# EAGLE board ALU (EAGLE 9.6.2)
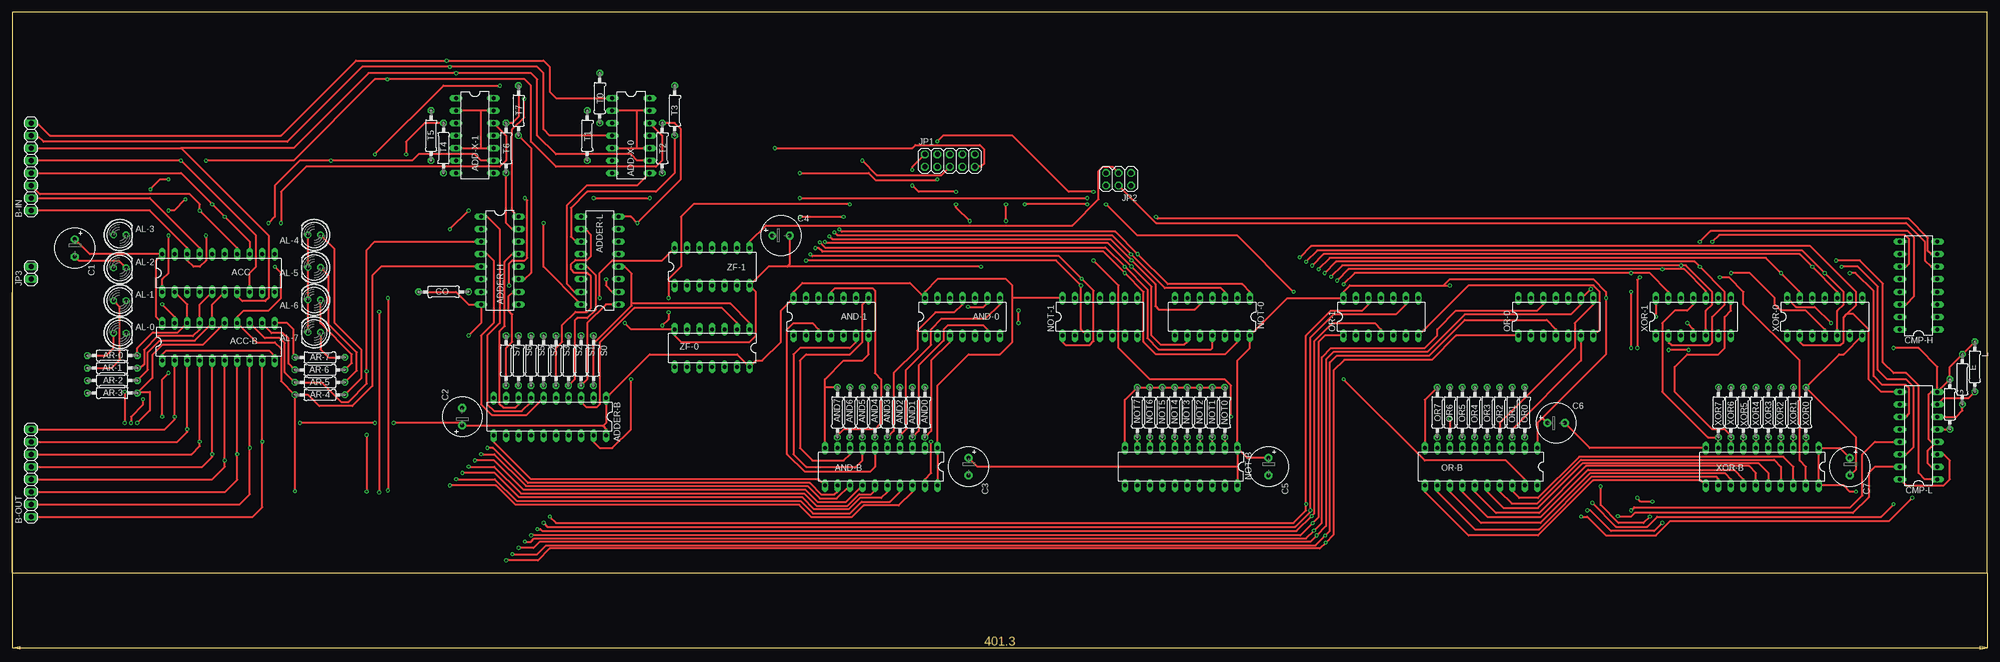
[diagram p3: board, top side]
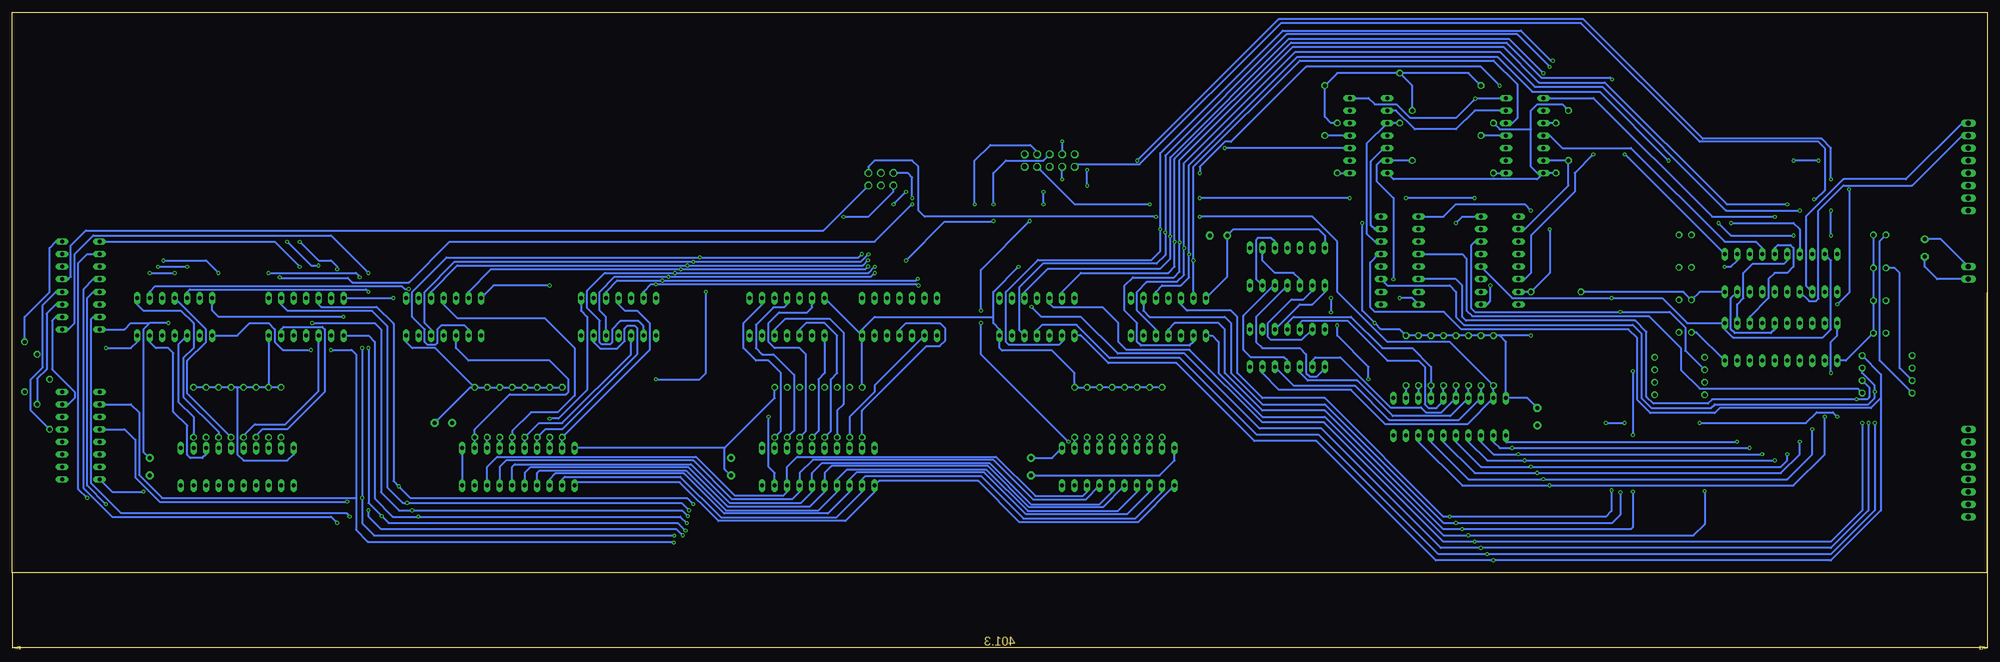
[diagram p4: board, bottom side, seen from below]

Size 401.3 x 113.97 mm. Coordinates in mm from the lower left corner, seen from the top.
Outline: 0,0 401.3,0 401.3,113.97 0,113.97 0,0
Copper layers (1*16): Top 0.035mm / dielectric 1.5mm / Bottom 0.035mm
Design rules "default": minimum track width 6mil, minimum drill 0.35mm, track to track 6mil, track to pad 6mil, pad to pad 6mil, via to via 6mil, smd to smd 6mil, copper to edge 40mil, drill to drill 6mil, minimum pad ring 10mil, minimum via ring 8mil, stop-mask expansion 4mil, vias tented up to drill 0mil, thermal gap 10mil

## Footprints (pad centres in the part's own frame; a part is rotated, then mirrored left to right if it is on the bottom)
DIL20 = drill 0.813 long: 1 -11.43,-3.81; 2 -8.89,-3.81; 3 -6.35,-3.81; 4 -3.81,-3.81; 5 -1.27,-3.81; 6 1.27,-3.81; 7 3.81,-3.81; 8 6.35,-3.81; 9 8.89,-3.81; 10 11.43,-3.81; 11 11.43,3.81; 12 8.89,3.81; 13 6.35,3.81; 14 3.81,3.81; 15 1.27,3.81; 16 -1.27,3.81; 17 -3.81,3.81; 18 -6.35,3.81; 19 -8.89,3.81; 20 -11.43,3.81
DIL14 = drill 0.813 long: 1 -7.62,-3.81; 2 -5.08,-3.81; 3 -2.54,-3.81; 4 0,-3.81; 5 2.54,-3.81; 6 5.08,-3.81; 7 7.62,-3.81; 8 7.62,3.81; 9 5.08,3.81; 10 2.54,3.81; 11 0,3.81; 12 -2.54,3.81; 13 -5.08,3.81; 14 -7.62,3.81
DIL16 = drill 0.813 long: 1 -8.89,-3.81; 2 -6.35,-3.81; 3 -3.81,-3.81; 4 -1.27,-3.81; 5 1.27,-3.81; 6 3.81,-3.81; 7 6.35,-3.81; 8 8.89,-3.81; 9 8.89,3.81; 10 6.35,3.81; 11 3.81,3.81; 12 1.27,3.81; 13 -1.27,3.81; 14 -3.81,3.81; 15 -6.35,3.81; 16 -8.89,3.81
LED5MM = drill 0.813 octagon: A -1.27,0; K 1.27,0
0207/10 = drill 0.813 octagon: 1 -5.08,0; 2 5.08,0
1X08 = drill 1.016 long: 1 -8.89,0; 2 -6.35,0; 3 -3.81,0; 4 -1.27,0; 5 1.27,0; 6 3.81,0; 7 6.35,0; 8 8.89,0
E3,5-8 = drill 0.813 pad 1.6: + -1.778,0 | drill 0.813 pad 1.6 octagon: - 1.778,0
2X05 = drill 1.016 octagon: 1 -5.08,-1.27; 2 -5.08,1.27; 3 -2.54,-1.27; 4 -2.54,1.27; 5 0,-1.27; 6 0,1.27; 7 2.54,-1.27; 8 2.54,1.27; 9 5.08,-1.27; 10 5.08,1.27
2X03 = drill 1.016 octagon: 1 -2.54,-1.27; 2 -2.54,1.27; 3 0,-1.27; 4 0,1.27; 5 2.54,-1.27; 6 2.54,1.27
1X02 = drill 1.016 long: 1 -1.27,0; 2 1.27,0

## Placement (x,y rotation side)
ACC  74273N  [DIL20]  41.91,60.96 0 top
ACC-B  74245N  [DIL20]  41.91,46.99 0 top
ADD-X-0  7486N  [DIL14]  125.73,88.9 270 top
ADD-X-1  7486N  [DIL14]  93.98,88.9 270 top
ADDER-B  74245N  [DIL20]  109.22,31.75 180 top
ADDER-H  74283N  [DIL16]  99.06,63.5 270 top
ADDER-L  74283N  [DIL16]  119.38,63.5 90 top
AL-0  [LED5MM]  21.84,48.77 0 top
AL-1  [LED5MM]  21.84,55.37 0 top
AL-2  [LED5MM]  21.84,61.98 0 top
AL-3  [LED5MM]  21.84,68.71 0 top
AL-4  [LED5MM]  61.34,68.71 180 top
AL-5  [LED5MM]  61.34,62.1 180 top
AL-6  [LED5MM]  61.34,55.5 180 top
AL-7  [LED5MM]  61.34,48.9 180 top
AND0  [0207/10]  185.42,32.64 270 top
AND1  [0207/10]  182.88,32.64 270 top
AND2  [0207/10]  180.34,32.64 270 top
AND3  [0207/10]  177.8,32.64 270 top
AND4  [0207/10]  175.26,32.64 270 top
AND5  [0207/10]  172.72,32.64 270 top
AND6  [0207/10]  170.18,32.64 270 top
AND7  [0207/10]  167.64,32.64 270 top
AND-0  74LS00N  [DIL14]  193.04,52.07 0 top
AND-1  74LS00N  [DIL14]  166.37,52.07 0 top
AND-B  74245N  [DIL20]  176.53,21.59 180 top
AR-0  [0207/10]  20.32,44.2 0 top
AR-1  [0207/10]  20.32,41.66 0 top
AR-2  [0207/10]  20.32,39.12 0 top
AR-3  [0207/10]  20.32,36.58 0 top
AR-4  [0207/10]  62.48,36.2 180 top
AR-5  [0207/10]  62.48,38.73 180 top
AR-6  [0207/10]  62.48,41.27 180 top
AR-7  [0207/10]  62.48,43.81 180 top
B-IN  [1X08]  3.81,82.55 90 top
B-OUT  [1X08]  3.81,20.32 90 top
C1  [E3,5-8]  12.7,66.04 270 top
C2  [E3,5-8]  91.44,31.75 90 top
C3  [E3,5-8]  194.31,21.59 270 top
C4  [E3,5-8]  156.21,68.58 0 top
C5  [E3,5-8]  255.27,21.59 270 top
C6  [E3,5-8]  313.69,30.48 0 top
C7  [E3,5-8]  373.38,21.59 270 top
CMP-H  7485AN  [DIL16]  387.35,58.42 90 top
CMP-L  7485AN  [DIL16]  387.35,27.94 90 top
CO  [0207/10]  87.63,57.15 0 top
E  [0207/10]  396.24,39.37 270 top
G  [0207/10]  393.7,34.29 270 top
JP1  [2X05]  190.5,83.82 0 top
JP2  [2X03]  224.79,80.01 180 top
JP3  [1X02]  3.81,60.96 90 top
L  [0207/10]  398.78,41.91 270 top
NOT0  [0207/10]  246.38,32.64 270 top
NOT1  [0207/10]  243.84,32.64 270 top
NOT2  [0207/10]  241.3,32.64 270 top
NOT3  [0207/10]  238.76,32.64 270 top
NOT4  [0207/10]  236.22,32.64 270 top
NOT5  [0207/10]  233.68,32.64 270 top
NOT6  [0207/10]  231.14,32.64 270 top
NOT7  [0207/10]  228.6,32.64 270 top
NOT-0  7404N  [DIL14]  243.84,52.07 180 top
NOT-1  7404N  [DIL14]  220.98,52.07 0 top
NOT-B  74245N  [DIL20]  237.49,21.59 180 top
OR0  [0207/10]  307.34,32.64 270 top
OR1  [0207/10]  304.8,32.64 270 top
OR2  [0207/10]  302.26,32.64 270 top
OR3  [0207/10]  299.72,32.64 270 top
OR4  [0207/10]  297.18,32.64 270 top
OR5  [0207/10]  294.64,32.64 270 top
OR6  [0207/10]  292.1,32.64 270 top
OR7  [0207/10]  289.56,32.64 270 top
OR-0  7432N  [DIL14]  313.69,52.07 0 top
OR-1  7432N  [DIL14]  278.13,52.07 0 top
OR-B  74245N  [DIL20]  298.45,21.59 180 top
S0  [0207/10]  118.11,43.18 270 top
S1  [0207/10]  115.57,43.18 270 top
S2  [0207/10]  113.03,43.18 270 top
S3  [0207/10]  110.49,43.18 270 top
S4  [0207/10]  107.95,43.18 270 top
S5  [0207/10]  105.41,43.18 270 top
S6  [0207/10]  102.87,43.18 270 top
S7  [0207/10]  100.33,43.18 270 top
T0  [0207/10]  119.38,96.52 270 top
T1  [0207/10]  116.84,88.9 270 top
T2  [0207/10]  132.08,86.36 270 top
T3  [0207/10]  134.62,93.98 270 top
T4  [0207/10]  87.63,86.36 90 top
T5  [0207/10]  85.09,88.9 270 top
T6  [0207/10]  100.33,86.36 270 top
T7  [0207/10]  102.87,93.98 270 top
XOR0  [0207/10]  364.49,32.64 270 top
XOR1  [0207/10]  361.95,32.64 270 top
XOR2  [0207/10]  359.41,32.64 270 top
XOR3  [0207/10]  356.87,32.64 270 top
XOR4  [0207/10]  354.33,32.64 270 top
XOR5  [0207/10]  351.79,32.64 270 top
XOR6  [0207/10]  349.25,32.64 270 top
XOR7  [0207/10]  346.71,32.64 270 top
XOR-0  7486N  [DIL14]  368.3,52.07 0 top
XOR-1  7486N  [DIL14]  341.63,52.07 0 top
XOR-B  74245N  [DIL20]  355.6,21.59 180 top
ZF-0  74LS00N  [DIL14]  142.24,45.72 180 top
ZF-1  74LS00N  [DIL14]  142.24,62.23 0 top

## Tracks (layer width: path | path; a pad name or v marks a point on that pad's centre or on a via)
ACC-0  (via drill 0.35)
  Top 0.4: ACC.2 35.56,54.61 ACC-B.18 33.66,48.9 28.57,48.9 25.4,45.72 AR-0.2 | v100.33,2.54 106.81,2.54 109.22,4.95 265.68,4.95 v266.89,6.16 268.48,7.75 268.48,41.15 270.64,43.31 288.42,43.31 293.37,48.26 OR-0.1 | v340.61,45.34 v336.55,45.34
  Bottom 0.4: AR-0.2 21.59,40.39 21.59,35.56 | ADDER-L.5 123.7,64.77 125.35,63.12 125.35,53.98 124.46,53.09 110.36,53.09 106.81,49.53 72.9,49.53 71.12,47.75 71.12,35.18 68.45,32.51 55.37,32.51 54.36,33.53 23.62,33.53 21.59,35.56 | 21.59,35.56 21.59,12.7 31.75,2.54 v100.33,2.54 112.07,2.54 136.32,26.8 148.9,26.8 164.77,42.67 178.56,42.67 184.15,48.26 AND-0.1 | XOR-0.1 355.6,48.26 353.06,50.8 349.25,50.8 347.98,49.53 347.98,46.99 346.33,45.34 v340.61,45.34 | v336.55,45.34 332.36,45.34 331.47,44.45 331.47,15.24 | 331.47,15.24 331.47,8.76 329.06,6.35 267.08,6.35 v266.89,6.16 | CMP-L.10 377.19,34.29 375.54,32.64 375.54,19.94 370.84,15.24 331.47,15.24
ACC-1  (via drill 0.35)
  Top 0.4: ACC.5 38.1,54.61 ACC-B.17 38.1,49.53 36.7,48.13 29.59,48.13 26.8,45.34 26.8,42.42 26.04,41.66 AR-1.2 | v22.86,36.83 v22.86,30.48 | v101.6,3.81 106.68,3.81 108.46,5.59 264.8,5.59 v266.76,7.56 267.72,8.51 267.72,42.8 269.11,44.2 287.91,44.2 295.15,51.44 311.79,51.44 313.69,49.53 OR-0.4 | XOR-0.4 368.3,49.53 364.49,53.34 359.41,53.34 358.14,54.61 358.14,55.88 353.06,60.96 v349.25,60.96 | v330.71,60.07 330.2,59.56 v330.2,45.72 | v333.25,14.48 330.96,14.48 v330.2,15.24
  Bottom 0.4: ADDER-L.3 121.92,58.42 109.22,58.42 107.95,57.15 107.95,52.07 106.3,50.42 72.01,50.42 70.23,48.64 70.23,35.56 68.2,33.53 56.13,33.53 55.37,34.29 24.13,34.29 22.86,35.56 v22.86,36.83 22.86,38.1 25.4,40.64 AR-1.2 | v22.86,30.48 22.86,12.7 31.75,3.81 v101.6,3.81 111.54,3.81 135.8,28.07 148.37,28.07 163.99,43.69 178.31,43.69 185.04,50.42 192.02,50.42 193.04,49.4 AND-0.4 | v349.25,60.96 331.47,60.96 330.71,60.2 v330.71,60.07 | v330.2,45.72 v330.2,15.24 330.2,10.03 327.79,7.62 266.83,7.62 v266.76,7.56 | CMP-L.12 378.46,29.21 376.3,27.05 376.3,19.43 371.35,14.48 v333.25,14.48
ACC-2  (via drill 0.35)
  Top 0.4: ACC.6 40.64,54.61 ACC-B.16 37.08,47.24 29.97,47.24 27.56,44.83 27.56,41.27 AR-2.2 | v26.54,35.31 26.54,34.16 24.13,31.75 v24.13,30.48 | v194.18,54.1 197.36,54.1 198.12,54.86 AND-0.9 | v102.87,5.08 105.92,5.08 107.19,6.35 263.78,6.35 v265.05,7.62 266.95,9.53 266.95,43.43 268.48,44.96 287.53,44.96 295.15,52.58 316.74,52.58 318.77,54.61 OR-0.9 318.96,55.88 v320.77,57.69 | v328.93,12.7 329.56,13.34 373.51,13.34 375.92,15.75 375.92,24.13 378.46,26.67 CMP-L.13
  Bottom 0.4: AR-2.2 24,37.72 24,35.69 24.38,35.31 v26.54,35.31 55.88,35.31 56.77,34.42 67.82,34.42 69.22,35.81 69.22,49.02 71.5,51.31 105.92,51.31 106.68,52.07 106.68,58.42 107.95,59.69 ADDER-L.14 | v24.13,30.48 24.13,12.7 31.75,5.08 v102.87,5.08 111.02,5.08 135.27,29.34 147.85,29.34 163.09,44.58 176.66,44.58 184.15,52.07 192.15,52.07 v194.18,54.1 | XOR-0.9 373.38,57.15 372.24,58.29 322.14,58.29 321.54,57.69 v320.77,57.69 | v265.05,7.62 266.32,8.89 326.39,8.89 328.93,11.43 v328.93,12.7
ACC-3  (via drill 0.35)
  Top 0.4: ACC-B.15 38.73,46.35 30.48,46.35 28.45,44.32 28.45,39.62 AR-3.2 25.65,36.83 27.94,36.83 27.94,33.02 v25.4,30.48 | v104.14,6.35 105.41,6.35 106.05,6.99 262.89,6.99 v264.48,8.57 266.06,10.16 266.06,43.81 267.97,45.72 287.02,45.72 289.56,48.26 289.56,49.53 293.37,53.34 309.88,53.34 311.15,54.61 OR-0.12 | v328.93,57.15 v328.93,45.72 | CMP-L.15 378.46,21.59 377.19,20.32 377.19,15.37 374.01,12.19 329.69,12.19 328.93,11.43 326.39,11.43 v326.26,11.56
  Bottom 0.4: ACC-B.15 43.18,49.53 43.94,48.77 51.31,48.77 52.07,49.53 52.07,55.88 ACC.9 | ADDER-L.12 106.68,64.77 105.79,63.88 105.79,53.34 104.65,52.2 68.71,52.2 62.23,45.72 62.23,41.27 58.42,37.47 26.29,37.47 AR-3.2 | v25.4,30.48 25.4,12.7 31.75,6.35 v104.14,6.35 110.49,6.35 134.75,30.61 147.32,30.61 162.05,45.34 174.88,45.34 176.53,46.99 176.53,50.8 179.71,53.98 189.74,53.98 190.5,54.74 AND-0.12 | XOR-0.12 365.76,57.15 365.25,57.66 329.44,57.66 v328.93,57.15 | v328.93,45.72 328.93,14.22 v326.26,11.56 324.87,10.16 266.06,10.16 v264.48,8.57
ACC-4  (via drill 0.35)
  Top 0.4: v53.34,62.23 54.61,60.96 54.61,55.88 52.07,53.34 46.99,53.34 45.72,52.07 ACC-B.14 49.66,46.86 53.34,46.86 54.61,45.59 54.61,38.99 AR-4.2 | AR-4.2 60.07,36.2 62.36,33.91 69.09,33.91 73.15,37.97 73.15,60.45 74.93,62.23 ADDER-H.5 | AR-4.2 v57.4,16.64 | v105.41,7.62 261.75,7.62 v264.22,10.1 265.43,11.3 265.43,46.99 266.7,48.26 OR-1.1 | v318.77,11.43 320.04,11.43 323.85,7.62 334.01,7.62 336.93,10.54 381.38,10.54 v386.08,15.24
  Bottom 0.4: v53.34,62.23 52.07,62.23 50.8,63.5 ACC.12 | v57.4,16.64 57.4,9.91 59.69,7.62 v105.41,7.62 110.49,7.62 134.62,31.75 147.32,31.75 156.21,40.64 156.21,46.99 157.48,48.26 AND-1.1 | XOR-1.1 328.93,48.26 327.66,46.99 327.66,15.11 323.98,11.43 v318.77,11.43 265.56,11.43 v264.22,10.1 | CMP-H.10 386.08,64.77 387.86,62.99 387.86,17.02 v386.08,15.24
ACC-5  (via drill 0.35)
  Top 0.4: ACC-B.13 51.31,47.75 54.36,47.75 55.37,46.74 55.37,40.77 AR-5.2 62.87,38.73 66.8,34.8 68.33,34.8 72.01,38.48 v72.01,41.02 72.01,65.66 73.66,67.31 ADDER-H.3 | v72.01,28.07 v72.01,16.51 | v106.68,8.89 107.31,8.89 107.7,8.51 260.99,8.51 v264.03,11.56 264.54,12.06 264.54,47.12 268.22,50.8 276.86,50.8 278.13,49.53 OR-1.4 | XOR-1.4 341.63,49.53 v340.36,50.8 | v335.28,10.16 333.63,8.51 324.87,8.51 320.68,12.7 v320.04,12.7
  Bottom 0.4: ACC.15 43.18,66.04 42.55,66.67 40.01,66.67 39.37,66.04 39.37,62.23 40.64,60.96 43.18,60.96 44.45,59.69 44.45,55.88 48.26,52.07 ACC-B.13 | v72.01,41.02 v72.01,28.07 | v72.01,16.51 72.01,9.27 72.39,8.89 v106.68,8.89 110.49,8.89 134.62,33.02 147.32,33.02 154.94,40.64 154.94,49.53 156.21,50.8 165.1,50.8 166.37,49.53 AND-1.4 | v264.03,11.56 265.18,12.7 v320.04,12.7 322.71,12.7 326.39,16.38 326.39,49.53 327.66,50.8 v340.36,50.8 | CMP-H.12 384.81,59.69 386.84,57.66 386.84,17.27 381,11.43 336.55,11.43 v335.28,10.16
ACC-6  (via drill 0.35)
  Top 0.4: AR-6.2 56.13,42.55 56.13,47.62 54.99,48.77 52.7,48.77 50.8,50.67 ACC-B.12 | v74.55,53.09 v74.55,16.38 | v107.95,10.16 108.71,9.4 260.73,9.4 263.78,12.45 v263.78,12.7 263.78,47.88 268.48,52.58 281.18,52.58 283.21,54.61 OR-1.9 | v321.06,14.22 325.88,9.4 332.23,9.4 334.26,11.43 379.73,11.43 v382.27,13.97
  Bottom 0.4: ACC.16 40.64,63.5 41.27,62.87 47.62,62.87 49.53,60.96 49.53,55.88 50.8,54.61 ACC-B.12 | ADDER-H.14 104.14,67.31 104.9,66.55 104.9,53.85 104.14,53.09 v74.55,53.09 64.52,53.09 61.34,49.91 61.34,45.21 AR-6.2 | v74.55,16.38 74.55,11.81 76.2,10.16 v107.95,10.16 110.49,10.16 134.62,34.29 147.32,34.29 153.67,40.64 153.67,50.8 154.94,52.07 170.18,52.07 171.45,53.34 AND-1.9 | XOR-1.9 346.71,54.61 345.44,53.34 328.3,53.34 325.12,50.16 325.12,17.4 321.94,14.22 v321.06,14.22 265.3,14.22 v263.78,12.7 | v382.27,13.97 386.08,17.78 386.08,55.88 384.81,57.15 CMP-H.13
ACC-7  (via drill 0.35)
  Top 0.4: AR-7.2 57.15,44.07 57.15,49.53 55.88,50.8 ACC-B.11 | v76.33,55.88 v76.33,16.76 | v109.22,11.43 110.49,10.16 260.35,10.16 262.89,12.7 v262.89,13.97 262.89,48.26 267.97,53.34 274.32,53.34 275.59,54.61 OR-1.12 | v332.74,11.43 331.47,10.16 326.39,10.16 322.77,13.78 v322.77,17.59
  Bottom 0.4: ACC.19 31.75,63.5 31.75,49.53 33.4,47.88 51.69,47.88 53.34,49.53 ACC-B.11 60.96,50.8 66.04,55.88 v76.33,55.88 96.52,55.88 ADDER-H.12 | v76.33,16.76 76.33,12.57 77.47,11.43 v109.22,11.43 110.49,11.43 134.62,35.56 147.32,35.56 152.4,40.64 152.4,52.07 153.67,53.34 162.56,53.34 163.83,54.61 AND-1.12 | XOR-1.12 339.09,54.61 338.58,54.1 327.28,54.1 323.85,50.67 323.85,18.67 v322.77,17.59 320.42,15.24 264.16,15.24 v262.89,13.97 | CMP-H.15 384.81,52.07 385.32,51.56 385.32,18.29 379.22,12.19 333.5,12.19 v332.74,11.43
ACC-B  (via drill 0.35)
  Top 0.4: ACC-B.19 33.02,52.07 v30.48,54.61 | v28.07,77.98 30.1,80.01 v31.75,80.01 | v172.72,83.82 175.64,80.9 188.85,80.9 JP1.5
  Bottom 0.4: v30.48,54.61 27.94,57.15 27.94,77.85 v28.07,77.98 | v31.75,80.01 31.75,86.36 33.66,88.27 57.78,88.27 82.04,112.52 144.02,112.52 v172.72,83.82
ACC-CLR  (via drill 0.35)
  Top 0.4: ACC.1 30.48,59.69 31.75,60.96 v31.75,68.58 | v35.18,75.95 32.89,73.66 v31.75,73.66
  Bottom 0.4: v31.75,68.58 v31.75,73.66 | JP1.1 184.91,83.06 172.21,83.06 143.51,111.76 82.55,111.76 58.42,87.63 34.29,87.63 33.02,86.36 33.02,77.72 34.8,75.95 v35.18,75.95
ACC-CP  (via drill 0.35)
  Top 0.4: v73.66,85.09 87.63,99.06 v99.06,99.06 | v160.02,81.28 173.99,81.28 175.51,79.76 187.71,79.76 v187.96,80.01
  Bottom 0.4: ACC.11 v73.66,85.09 | v99.06,99.06 102.87,102.87 138.43,102.87 153.67,87.63 154.94,87.63 160.02,82.55 v160.02,81.28 | v187.96,80.01 JP1.3
ADDER-B  (via drill 0.35)
  Top 0.4: v170.18,74.93 138.43,74.93 135.89,72.39 135.89,62.23 133.35,59.69 v133.35,55.88 | ADDER-B.19 118.11,26.67 119.38,25.4 121.92,25.4 125.73,29.21 v125.73,39.37 | v133.35,52.96 133.35,51.56 v132.08,50.29
  Bottom 0.4: JP1.7 185.42,74.93 v170.18,74.93 | v125.73,39.37 125.73,41.91 132.08,48.26 v132.08,50.29 | v133.35,55.88 v133.35,52.96
AND-0
  Top 0.4: AND-0.3 190.5,46.99 186.69,43.18 186.69,28.83 AND0.2
  Bottom 0.4: AND-B.2 AND0.2
AND-1
  Top 0.4: AND-0.6 198.12,49.53 197.36,50.29 189.99,50.29 189.23,49.53 189.23,47.24 184.15,42.16 184.15,28.83 AND1.2
  Bottom 0.4: AND1.2 AND-B.3
AND-2
  Top 0.4: AND-0.8 200.66,54.61 197.74,51.69 188.85,51.69 186.69,49.53 186.69,46.35 181.61,41.27 181.61,29.21 180.34,27.94 AND2.2
  Bottom 0.4: AND2.2 AND-B.4
AND-3
  Top 0.4: AND-0.11 193.04,54.61 191.39,52.96 187.58,52.96 183.9,49.28 183.9,45.47 179.07,40.64 179.07,28.83 AND3.2
  Bottom 0.4: AND3.2 AND-B.5
AND-4
  Top 0.4: AND-B.6 175.26,21.59 174.24,20.57 161.04,20.57 157.48,24.13 157.48,49.53 158.75,50.8 162.56,50.8 163.83,49.53 AND-1.3
  Bottom 0.4: AND4.2 AND-B.6
AND-5
  Top 0.4: AND-1.6 171.45,46.99 170.18,45.72 160.02,45.72 158.75,44.45 158.75,24.13 161.29,21.59 171.45,21.59 172.72,22.86 AND-B.7
  Bottom 0.4: AND-B.7 AND5.2
AND-6
  Top 0.4: AND-1.8 172.72,54.61 172.72,46.99 170.18,44.45 161.29,44.45 160.02,43.18 160.02,25.4 162.56,22.86 168.91,22.86 170.18,24.13 AND-B.8
  Bottom 0.4: AND6.2 AND-B.8
AND-7
  Top 0.4: AND-1.11 166.37,57.15 167.13,57.91 174.75,57.91 175.26,57.4 175.26,40.64 176.53,39.37 176.53,30.48 175.26,29.21 168.91,29.21 167.64,27.94 AND7.2
  Bottom 0.4: AND-B.9 AND7.2
AND-B  (via drill 0.35)
  Top 0.4: AND-B.19 185.42,19.05 186.69,20.32 v186.69,26.67 | v204.47,50.8 v204.47,53.34 | v194.56,71.5 191.77,74.3 v191.77,74.93 | v191.77,77.47 184.15,77.47 v182.88,78.74 | v182.88,81.92 182.88,82.55 JP1.2
  Bottom 0.4: v186.69,26.67 204.47,44.45 v204.47,50.8 | v204.47,53.34 204.47,61.59 v194.56,71.5 | v191.77,74.93 v191.77,77.47 | v182.88,78.74 v182.88,81.92
BI-0  (via drill 0.35)
  Top 0.4: B-IN.8 5.08,91.44 7.62,88.9 54.61,88.9 69.85,104.14 v88.27,104.14 107.95,104.14 109.22,102.87 109.22,97.79 110.49,96.52 ADD-X-0.1 | NOT-0.1 251.46,57.15 249.94,58.67 234.82,58.67 v228.66,64.83 224.16,69.34 168.53,69.34 v168.02,69.85 | XOR-0.2 363.22,46.99 363.86,46.35 371.48,46.35 372.11,46.99 372.11,51.94 372.81,52.64 | v261.62,64.14 263.91,66.42 365.38,66.42 374.65,57.15 374.65,54.48 372.81,52.64 | CMP-L.9 379.73,36.83 377.19,39.37 377.19,49.53 374.08,52.64 372.81,52.64
  Bottom 0.4: B-IN.8 5.08,91.44 16.51,80.01 29.21,80.01 36.83,72.39 36.83,58.42 ACC.3 | AND-0.2 187.96,46.99 188.59,46.35 198.75,46.35 199.39,46.99 199.39,57.15 192.91,63.63 169.8,63.63 168.02,65.41 v168.02,69.85 168.02,85.34 143.13,110.24 94.74,110.24 88.65,104.14 v88.27,104.14 | OR-0.2 308.61,49.53 309.37,50.29 314.2,50.29 314.96,49.53 314.96,46.74 315.34,46.35 316.87,46.35 317.5,46.99 317.5,49.53 320.04,52.07 320.04,57.15 313.06,64.14 v261.62,64.14 229.36,64.14 v228.66,64.83
BI-1  (via drill 0.35)
  Top 0.4: ADD-X-0.4 109.22,88.9 107.95,90.17 107.95,101.6 106.68,102.87 v88.9,102.87 71.12,102.87 55.88,87.63 6.35,87.63 5.08,88.9 B-IN.7 | NOT-0.3 246.38,57.15 245.62,57.91 234.19,57.91 v227.33,64.77 223.52,68.58 167.64,68.58 v167,69.22 | XOR-0.5 370.84,53.34 372.11,54.61 372.11,57.15 v368.3,60.96 363.73,65.53 265.18,65.53 v262.89,63.25 | CMP-L.11 384.81,31.75 385.44,32.38 385.44,37.47 384.68,38.23 379.98,38.23 378.21,40.01 378.21,57.28 374.52,60.96 v373.38,60.96
  Bottom 0.4: B-IN.7 5.08,88.9 15.24,78.74 29.21,78.74 34.29,73.66 34.29,55.75 34.8,55.24 36.2,55.24 ACC.4 | v88.9,102.87 95.5,109.47 142.37,109.47 167,84.84 v167,69.22 167,64.64 168.78,62.87 191.9,62.87 196.72,58.04 196.72,49.4 AND-0.5 | OR-0.5 316.23,49.53 317.5,50.8 317.5,57.15 311.4,63.25 v262.89,63.25 228.85,63.25 v227.33,64.77 | v373.38,60.96 v368.3,60.96
BI-2  (via drill 0.35)
  Top 0.4: B-IN.6 34.29,86.36 | 34.29,86.36 52.07,68.58 52.07,55.88 51.44,55.24 46.74,55.24 45.72,56.26 ACC.7 | ADD-X-0.9 127,83.82 125.73,85.09 110.49,85.09 106.68,88.9 106.68,100.33 105.41,101.6 v90.17,101.6 72.39,101.6 57.15,86.36 34.29,86.36 | v165.99,68.45 166.62,67.82 223.14,67.82 v227.39,63.56 232.28,58.67 232.28,54.23 232.92,53.59 240.28,53.59 241.3,54.61 NOT-0.5 | XOR-0.10 370.84,57.15 v365.76,62.23 363.22,64.77 266.45,64.77 v264.16,62.48 | CMP-L.14 384.81,24.13 386.33,25.65 386.33,37.85 384.81,39.37 381,39.37 379.1,41.27 379.1,58.17 375.03,62.23 v371.73,62.23
  Bottom 0.4: AND-0.10 195.58,57.15 190.88,61.85 168.02,61.85 165.99,63.88 v165.99,68.45 165.99,84.45 141.86,108.58 97.16,108.58 v90.17,101.6 | OR-0.10 316.23,57.15 310.9,62.48 v264.16,62.48 228.47,62.48 v227.39,63.56 | v371.73,62.23 v365.76,62.23
BI-3  (via drill 0.35)
  Top 0.4: ACC.8 48.26,60.96 49.53,62.23 49.53,68.58 v34.29,83.82 B-IN.5 | v39.37,83.82 57.15,83.82 73.66,100.33 v76.2,100.33 104.14,100.33 105.41,99.06 105.41,87.63 110.49,82.55 130.81,82.55 132.08,83.82 132.08,88.9 ADD-X-0.12 | NOT-0.9 238.76,46.99 238.12,46.35 233.43,46.35 231.52,48.26 231.52,58.17 v227.39,62.29 222.63,67.06 165.35,67.06 v165.1,67.31 | XOR-0.13 363.22,57.15 v359.41,60.96 356.36,64.01 267.72,64.01 v265.43,61.72 | CMP-L.1 388.62,19.05 387.35,20.32 387.35,38.1 384.81,40.64 382.27,40.64 380.11,42.8 380.11,58.8 375.41,63.5 v370.59,63.5
  Bottom 0.4: v34.29,83.82 v39.37,83.82 | AND-0.13 187.96,57.15 184.15,60.96 166.37,60.96 165.1,62.23 v165.1,67.31 165.1,84.2 141.48,107.82 97.66,107.82 90.55,100.71 76.58,100.71 v76.2,100.33 | OR-0.13 308.61,57.15 304.04,61.72 v265.43,61.72 227.97,61.72 v227.39,62.29 | v370.59,63.5 361.95,63.5 v359.41,60.96
BI-4  (via drill 0.35)
  Top 0.4: B-IN.4 34.29,81.28 v40.64,74.93 v43.18,72.39 48.26,67.31 ACC.13 | v164.08,67.18 165.1,66.17 222.12,66.17 v226.06,62.23 230.63,57.66 230.63,47.75 232.92,45.47 243.59,45.47 243.84,45.72 NOT-0.11 | XOR-1.2 336.55,46.99 337.19,46.35 344.93,46.35 345.44,46.86 345.44,52.07 347.98,54.61 347.98,57.15 v342.9,62.23 341.88,63.25 268.99,63.25 v266.7,60.96
  Bottom 0.4: ADD-X-1.1 80.01,96.52 55.88,72.39 v43.18,72.39 | AND-1.2 161.29,46.99 162.05,46.23 171.96,46.23 172.72,46.99 172.72,50.8 175.26,53.34 175.26,58.42 173.61,60.07 165.23,60.07 164.08,61.21 v164.08,67.18 164.08,83.95 141.1,106.93 98.3,106.93 91.06,99.69 77.72,99.69 52.96,74.93 v40.64,74.93 | OR-1.2 273.05,50.16 274.07,51.18 277.75,51.18 279.4,49.53 279.4,46.86 279.78,46.48 281.56,46.48 281.94,46.86 281.94,51.31 284.48,53.85 284.48,57.4 280.92,60.96 v266.7,60.96 227.33,60.96 v226.06,62.23 | v342.9,62.23 347.98,67.31 CMP-H.9
BI-5  (via drill 0.35)
  Top 0.4: ACC.14 45.72,66.04 v38.1,73.66 38.1,74.93 36.07,76.96 5.59,76.96 B-IN.3 | NOT-0.13 248.92,46.99 246.38,44.45 232.41,44.45 229.87,46.99 229.87,57.15 v226.06,60.96 221.74,65.28 164.59,65.28 163.83,66.04 v163.19,66.04 | XOR-1.5 344.17,53.34 345.44,54.61 345.44,57.15 340.11,62.48 v339.09,62.48 270.26,62.48 v267.97,60.2 | CMP-H.11 384.81,62.23 385.44,62.87 385.44,67.82 384.56,68.71 346.84,68.71 v345.44,67.31
  Bottom 0.4: ADD-X-1.4 88.9,88.9 86.36,86.36 72.39,86.36 53.34,67.31 46.99,67.31 45.72,66.04 ACC.14 | AND-1.5 168.91,49.53 172.72,53.34 172.72,57.15 170.69,59.18 164.59,59.18 163.19,60.58 v163.19,66.04 163.19,83.31 140.59,105.92 99.06,105.92 91.95,98.81 78.23,98.81 53.09,73.66 v38.1,73.66 | v226.06,60.96 226.82,60.2 v267.97,60.2 278.89,60.2 281.94,57.15 281.94,53.34 280.67,52.07 OR-1.5 | v345.44,67.31 340.61,62.48 v339.09,62.48
BI-6  (via drill 0.35)
  Top 0.4: B-IN.2 27.94,76.2 38.1,66.04 ACC.17 | ADD-X-1.9 95.25,83.82 93.98,85.09 82.55,85.09 81.28,83.82 v64.77,83.82 58.42,83.82 53.34,78.74 53.34,72.39 v52.07,71.12 | NOT-1.1 213.36,46.99 214,46.35 218.95,46.35 219.71,47.12 219.71,57.4 v217.3,59.82 212.72,64.39 162.56,64.39 v162.18,64.77 | XOR-1.10 344.17,57.28 339.73,61.72 v335.28,61.72 271.53,61.72 v269.24,59.44 | CMP-H.14 384.81,54.61 386.46,56.26 386.46,68.2 385.19,69.47 345.06,69.47 v342.9,67.31
  Bottom 0.4: v52.07,71.12 39.37,71.12 38.1,69.85 ACC.17 | AND-1.10 168.91,57.15 167.64,58.42 163.83,58.42 162.18,60.07 v162.18,64.77 162.18,82.93 140.21,104.9 99.57,104.9 92.46,97.79 78.74,97.79 v64.77,83.82 | OR-1.10 280.67,57.15 278.38,59.44 v269.24,59.44 217.68,59.44 v217.3,59.82 | v342.9,67.31 339.09,63.5 336.55,63.5 335.28,62.23 v335.28,61.72
BI-7  (via drill 0.35)
  Top 0.4: B-IN.1 27.94,73.66 35.56,66.04 ACC.18 35.56,63.5 36.83,62.23 38.1,62.23 39.37,63.5 v39.37,68.58 | ADD-X-1.12 100.33,88.9 100.33,83.82 99.06,82.55 59.69,82.55 54.61,77.47 v54.61,71.12 | NOT-1.3 217.17,49.53 v217.17,58.42 212.09,63.5 v161.29,63.5 | XOR-1.13 336.55,57.15 332.74,60.96 v328.93,60.96 272.8,60.96 v270.51,58.67
  Bottom 0.4: v54.61,71.12 52.07,68.58 v39.37,68.58 | AND-1.13 v161.29,63.5 161.29,82.55 139.7,104.14 100.33,104.14 95.5,99.31 95.5,92.46 96.52,91.44 ADD-X-1.12 | OR-1.13 273.05,57.15 271.53,58.67 v270.51,58.67 217.42,58.67 v217.17,58.42 | CMP-H.1 389.89,49.53 388.62,50.8 388.62,64.77 384.81,68.58 336.55,68.58 v328.93,60.96
BO-0  (via drill 0.35)
  Top 0.4: B-OUT.8 30.99,29.21 33.02,31.24 v33.02,31.75 ACC-B.2 | AND-B.18 182.88,16.51 180.09,13.72 172.97,13.72 170.56,11.3 162.43,11.3 159.89,13.84 102.23,13.84 98.3,17.78 v88.9,17.78 | OR-B.18 304.8,16.64 306.2,15.24 310.01,15.24 318.39,23.62 359.92,23.62 361.95,21.59 XOR-B.18
  Bottom 0.4: ADDER-B.18 115.57,26.67 106.68,17.78 v88.9,17.78 39.37,17.78 33.02,24.13 v33.02,31.75 | AND-B.18 182.88,16.51 183.77,15.62 193.42,15.62 201.42,23.62 241.81,23.62 243.84,21.59 NOT-B.18 243.84,16.51 244.6,15.75 254.51,15.75 262.38,23.62 302.77,23.62 304.8,21.59 OR-B.18
BO-1  (via drill 0.35)
  Top 0.4: B-OUT.7 33.53,26.67 35.56,28.7 v35.56,29.21 ACC-B.3 | AND-B.17 180.34,16.51 178.31,14.48 172.59,14.48 170.18,12.06 162.69,12.06 160.15,14.61 102.49,14.61 98.04,19.05 v90.17,19.05 | OR-B.17 302.26,16.51 304.67,14.1 309.88,14.1 318.77,22.99 358.01,22.99 359.41,21.59 XOR-B.17
  Bottom 0.4: ADDER-B.17 113.03,26.67 105.41,19.05 v90.17,19.05 40.64,19.05 35.56,24.13 v35.56,29.21 | AND-B.17 183.26,14.86 193.8,14.86 201.93,22.99 238.63,22.99 241.3,20.32 NOT-B.17 241.3,16.51 242.82,14.99 255.02,14.99 262.89,22.86 300.99,22.86 302.26,21.59 OR-B.17
BO-2  (via drill 0.35)
  Top 0.4: B-OUT.6 36.45,24.13 38.1,25.78 v38.1,26.67 ACC-B.4 | AND-B.16 177.8,16.51 176.53,15.24 172.21,15.24 169.93,12.95 162.94,12.95 160.53,15.37 103,15.37 98.04,20.32 v91.44,20.32 | OR-B.16 299.72,16.51 303.02,13.21 310.01,13.21 319.15,22.35 354.84,22.35 356.87,20.32 XOR-B.16
  Bottom 0.4: ADDER-B.16 110.49,26.67 104.14,20.32 v91.44,20.32 41.91,20.32 38.1,24.13 v38.1,26.67 | AND-B.16 177.8,16.51 180.34,13.97 194.31,13.97 202.69,22.35 236.73,22.35 238.76,20.32 NOT-B.16 238.76,16.51 241.05,14.22 255.52,14.22 263.4,22.1 299.21,22.1 299.72,21.59 OR-B.16
BO-3  (via drill 0.35)
  Top 0.4: B-OUT.5 38.61,21.59 40.64,23.62 v40.64,24.13 ACC-B.5 | AND-B.15 175.26,16.76 174.5,16 172.09,16 169.67,13.59 163.45,13.59 160.91,16.13 103.38,16.13 97.92,21.59 v92.71,21.59 | OR-B.15 297.18,16.51 301.5,12.19 310.26,12.19 319.79,21.72 352.93,21.72 354.33,20.32 XOR-B.15
  Bottom 0.4: ADDER-B.15 107.95,26.67 102.87,21.59 v92.71,21.59 41.91,21.59 40.64,22.86 v40.64,24.13 | AND-B.15 179.71,13.34 194.69,13.34 203.07,21.72 234.82,21.72 236.22,20.32 NOT-B.15 236.22,16.51 239.27,13.46 255.91,13.46 263.91,21.46 296.04,21.46 297.18,20.32 OR-B.15
BO-4  (via drill 0.35)
  Top 0.4: B-OUT.4 40.64,19.05 43.18,21.59 v43.18,22.86 ACC-B.6 | AND-B.14 169.29,14.35 163.7,14.35 161.16,16.89 103.89,16.89 97.92,22.86 v93.98,22.86 | OR-B.14 294.64,16.51 299.72,11.43 310.64,11.43 320.17,20.95 349.88,20.95 351.79,19.05 XOR-B.14
  Bottom 0.4: ADDER-B.14 105.41,26.67 101.6,22.86 v93.98,22.86 v43.18,22.86 | AND-B.14 172.72,16.51 176.66,12.57 194.94,12.57 203.41,21.04 231.69,21.04 233.68,19.05 NOT-B.14 233.68,16.51 237.49,12.7 256.29,12.7 264.41,20.83 294.13,20.83 294.64,20.32 OR-B.14
BO-5  (via drill 0.35)
  Top 0.4: B-OUT.3 43.31,16.51 45.72,18.92 v45.72,24.13 ACC-B.7 | AND-B.13 167.51,15.11 164.08,15.11 161.54,17.65 104.39,17.65 97.92,24.13 v95.25,24.13 | XOR-B.13 349.25,19.05 348.11,20.19 320.55,20.19 310.51,10.16 298.45,10.16 292.1,16.51 OR-B.13
  Bottom 0.4: ADDER-B.13 102.87,26.67 100.33,24.13 v95.25,24.13 v45.72,24.13 | AND-B.13 170.18,16.51 174.75,11.94 195.33,11.94 203.84,20.45 229.74,20.45 231.14,19.05 NOT-B.13 231.14,16.51 235.59,12.06 256.67,12.06 264.8,20.19 290.96,20.19 292.1,19.05 OR-B.13
BO-6  (via drill 0.35)
  Top 0.4: B-OUT.2 46.23,13.97 48.26,16 v48.26,25.4 ACC-B.8 | AND-B.12 167.64,16.51 167,15.88 164.47,15.88 162.05,18.29 104.78,18.29 97.66,25.4 v96.52,25.4 | OR-B.12 289.56,16.51 297.18,8.89 310.26,8.89 320.95,19.58 346.18,19.58 346.71,19.05 XOR-B.12
  Bottom 0.4: ADDER-B.12 100.33,26.67 99.06,25.4 v96.52,25.4 v48.26,25.4 | AND-B.12 167.64,16.51 173.1,11.05 195.83,11.05 204.47,19.68 227.97,19.68 228.6,19.05 NOT-B.12 228.6,16.51 233.81,11.3 257.3,11.3 265.56,19.56 289.05,19.56 289.56,19.05 OR-B.12
BO-7  (via drill 0.35)
  Top 0.4: B-OUT.1 48.9,11.43 50.8,13.34 v50.8,26.67 ACC-B.9 | AND-B.11 163.83,19.05 105.41,19.05 97.79,26.67 ADDER-B.11 | OR-B.11 287.02,16.51 295.91,7.62 310.01,7.62 321.18,18.8 343.15,18.8 XOR-B.11
  Bottom 0.4: ADDER-B.11 97.79,26.67 v50.8,26.67 | AND-B.11 172.59,10.29 196.6,10.29 204.98,18.67 225.17,18.67 NOT-B.11 226.06,16.51 232.03,10.54 257.81,10.54 265.68,18.41 286.38,18.41 OR-B.11
CO  (via drill 0.35)
  Top 0.4: v92.71,73.66 v88.9,69.85
  Bottom 0.4: ADDER-H.7 CO.2 88.9,60.96 v88.9,69.85 | ADDER-L.9 110.49,72.39 107.95,74.93 93.98,74.93 v92.71,73.66
E
  Top 0.4: CMP-L.6 394.97,31.75 396.24,33.02 E.2
  Bottom 0.4: CMP-H.3 392.43,54.61 394.33,52.7 394.33,41.4 396.24,39.5 E.2
EF
  Top 0.4: CMP-H.6 389.89,62.23 388.62,63.5 388.62,67.31 384.81,71.12 232.41,71.12 JP2.4
G
  Top 0.4: CMP-L.5 G.2
  Bottom 0.4: G.2 397.51,33.02 397.51,39.37 395.1,41.78 395.1,54.48 392.43,57.15 CMP-H.4
GF
  Bottom 0.4: CMP-H.5 389.89,59.69 389.38,60.2 389.38,66.55 386.33,69.6 236.47,69.6 JP2.2
GND  (via drill 0.35)
  Top 0.4: AL-7.K AL-6.K AL-5.K AL-4.K | C1.- 13.46,63.5 21.59,63.5 AL-2.K | CO.1 90.17,57.15 92.71,54.61 ADDER-H.8 95.25,50.8 v92.71,48.26 | ADDER-L.8 125.73,72.39 v127,71.12 135.89,80.01 135.89,90.17 134.62,91.44 T2.1 | T7.1 102.87,92.71 101.6,91.44 T6.1 | AND-B.10 165.1,37.59 | 165.1,37.59 165.1,39.37 168.91,43.18 172.72,43.18 173.99,44.45 AND-1.7 | AND7.1 165.23,37.72 165.1,37.59 | v196.85,62.23 157.48,62.23 | 157.48,62.23 153.67,62.23 ZF-1.7 151.13,57.15 151.13,48.26 149.86,46.99 135.89,46.99 134.62,48.26 ZF-0.7 125.73,49.53 v124.46,50.8 | ACC-B.1 30.48,44.45 31.24,45.21 52.2,45.21 53.34,44.07 ACC-B.10 | C4.- 157.99,62.74 157.48,62.23 | NOT0.1 NOT1.1 NOT2.1 NOT3.1 NOT4.1 NOT5.1 NOT6.1 NOT7.1 226.06,35.18 NOT-B.10 | OR-0.7 322.58,49.53 322.58,57.15 321.31,58.42 295.91,58.42 OR-1.7 | OR7.1 287.02,35.18 OR-B.10 | XOR-B.10 320.55,25.4 C6.- | C7.- 374.65,21.08 374.65,27.56 XOR0.1 371.22,44.45 372.11,44.45 XOR-0.7 | CMP-L.8 G.1 393.7,41.91 E.1 L.1 | CMP-L.4 391.03,26.67 | 391.03,26.67 389.89,26.67 389.38,27.18 389.38,36.32 389.89,36.83 CMP-L.8 | CMP-L.2 389.89,21.59 389.25,22.23 389.25,24.89 391.03,26.67 | CMP-L.8 391.16,41.91 387.35,45.72 v382.27,45.72
  Bottom 0.4: AL-3.K AL-2.K AL-1.K AL-0.K 28.7,43.18 ACC-B.1 | ACC-B.10 59.05,48.9 AL-7.K | T4.1 ADD-X-1.7 | ADD-X-1.7 91.44,81.28 92.71,82.55 92.71,90.17 | T5.1 86.36,95.25 91.44,95.25 92.71,93.98 92.71,90.17 | T6.1 99.06,90.17 92.71,90.17 | ADD-X-1.7 91.44,80.01 120.65,80.01 ADD-X-0.7 | T2.1 133.35,91.44 134.62,92.71 T3.1 132.08,101.6 T0.1 | T1.1 116.84,99.06 T0.1 | T7.1 105.41,101.6 T0.1 | ACC.10 58.42,57.15 AL-6.K 61.72,57.15 CO.1 | v92.71,48.26 99.06,48.26 | 99.06,48.26 S7.1 S6.1 S5.1 S4.1 S3.1 S2.1 S1.1 S0.1 119.38,49.53 123.19,49.53 v124.46,50.8 127,53.34 v127,71.12 | C2.- 93.47,35.56 ADDER-B.10 97.79,46.99 99.06,48.26 | AND7.1 AND6.1 AND5.1 AND4.1 AND3.1 AND2.1 AND1.1 AND0.1 185.42,40.64 189.99,45.21 200.15,45.21 200.66,45.72 AND-0.7 200.66,49.53 201.93,50.8 201.93,52.07 | 201.93,52.07 201.93,57.15 v196.85,62.23 | C3.- 168.15,19.81 165.1,22.86 AND-B.10 | NOT-1.7 NOT-0.7 | NOT7.1 NOT-1.7 | C5.- 256.54,21.08 256.54,25.4 | NOT0.1 246.38,35.56 256.54,25.4 | NOT-1.7 228.6,49.53 226.06,52.07 201.93,52.07 | OR0.1 OR1.1 OR2.1 OR3.1 OR4.1 OR5.1 OR6.1 OR7.1 | OR0.1 315.34,45.72 320.04,45.72 321.31,46.99 OR-0.7 | 256.54,25.4 OR-B.10 | XOR7.1 XOR6.1 | XOR6.1 XOR5.1 XOR4.1 355.6,37.72 | 355.6,37.72 XOR3.1 XOR2.1 XOR1.1 XOR0.1 | XOR-1.7 XOR6.1 | XOR-B.10 344.17,24.13 345.44,22.86 354.33,22.86 355.6,24.13 355.6,37.72 | C6.- 308.23,37.72 OR0.1 | L.1 398.78,52.07 393.7,57.15 393.7,66.04 392.43,67.31 CMP-H.8 | v382.27,45.72 377.19,45.72 375.92,46.99 XOR-0.7 | JP3.1 10.16,59.69 12.7,62.23 C1.-
L
  Top 0.4: CMP-L.7 392.43,35.56 397.51,35.56 L.2
  Bottom 0.4: CMP-H.2 392.43,52.07 393.19,51.31 393.19,41.4 388.62,36.83 388.62,35.56 389.89,34.29 CMP-L.7
LF  (via drill 0.35)
  Top 0.4: CMP-H.7 389.89,64.77 389.25,65.41 389.25,68.07 385.32,72.01 232.79,72.01 v232.41,72.39
  Bottom 0.4: v232.41,72.39 227.33,72.39 222.25,77.47 JP2.6
N$1
  Top 0.4: AR-0.1 19.05,44.2 20.57,45.72 AL-0.A
N$4
  Top 0.4: AL-1.A 21.84,54.1 21.84,43.31 20.19,41.66 AR-1.1
N$7
  Bottom 0.4: AR-2.1 17.78,41.66 17.78,60.96 18.8,61.98 AL-2.A
N$10
  Bottom 0.4: AR-3.1 21.84,43.18 21.84,67.44 AL-3.A
N$13
  Top 0.4: AL-4.A 65.41,65.91 65.41,50.93 70.87,45.47 70.87,39.5 AR-4.1
N$14
  Bottom 0.4: ZF-0.11 142.24,43.18 142.88,43.81 149.61,43.81 151.13,45.34 151.13,52.32 145.03,58.42 ZF-1.5
N$15
  Bottom 0.4: ZF-1.4 148.59,52.07 148.59,46.99 147.32,45.72 139.7,45.72 138.43,44.45 138.43,40.68 137.67,39.92 136.23,39.92 134.62,41.53 ZF-0.8
N$16
  Top 0.4: AR-5.1 69.98,41.15 69.98,44.83 64.26,50.55 64.26,60.45 AL-5.A
N$17
  Bottom 0.4: ZF-1.2 137.16,57.4 138.94,55.63 141.35,55.63 146.18,50.8 146.18,48.01 145.54,47.37 139.32,47.37 ZF-0.6
N$18
  Bottom 0.4: ZF-0.3 139.7,54.61 137.16,54.61 134.62,57.15 ZF-1.1
N$19
  Top 0.4: AR-6.1 68.96,42.67 68.96,44.45 62.61,50.8 AL-6.A
N$20
  Bottom 0.4: ZF-1.3 139.7,59.69 140.97,60.96 144.78,60.96 147.32,63.5 ZF-1.9
N$21
  Bottom 0.4: ZF-1.10 144.78,67.31 145.54,68.07 148.21,68.07 148.59,67.69 148.59,59.69 ZF-1.6
N$22
  Top 0.4: AL-7.A 62.61,45.47 64.26,43.81 AR-7.1
NOT-0
  Top 0.4: NOT0.2 NOT-B.2
  Bottom 0.4: NOT0.2 245.11,28.83 245.11,40.64 247.65,43.18 250.19,43.18 252.73,45.72 252.73,50.8 248.92,54.61 NOT-0.2
NOT-1
  Top 0.4: NOT-B.3 NOT1.2
  Bottom 0.4: NOT-0.4 243.84,54.61 244.47,53.98 246.63,53.98 250.19,50.42 250.19,45.72 248.92,44.45 246.63,44.45 242.44,40.26 242.44,28.96 NOT1.2
NOT-2
  Top 0.4: NOT2.2 NOT-B.4
  Bottom 0.4: NOT2.2 240.03,28.83 240.03,44.45 241.3,45.72 246.38,45.72 247.65,46.99 247.65,50.8 245.49,52.96 239.78,52.96 238.76,53.98 NOT-0.6
NOT-3
  Top 0.4: NOT-B.5 NOT3.2
  Bottom 0.4: NOT-0.8 236.22,40.64 237.49,39.37 237.49,28.83 NOT3.2
NOT-4
  Top 0.4: NOT4.2 NOT-B.6
  Bottom 0.4: NOT4.2 234.95,28.83 234.95,39.37 233.68,40.64 233.68,48.26 236.22,50.8 240.03,50.8 241.3,49.53 NOT-0.10
NOT-5
  Top 0.4: NOT-B.7 NOT5.2
  Bottom 0.4: NOT-0.12 246.38,49.53 244.22,51.69 235.2,51.69 232.41,48.9 232.41,34.29 233.68,33.02 NOT5.2
NOT-6
  Top 0.4: NOT6.2 NOT-B.8
  Bottom 0.4: NOT-1.2 226.06,38.1 226.06,36.83 231.14,31.75 NOT6.2
NOT-7
  Top 0.4: NOT-B.9 NOT7.2
  Bottom 0.4: NOT7.2 228.6,33.02 215.52,46.1 212.85,46.1 211.71,47.24 211.71,49.66 212.72,50.67 219.84,50.67 220.98,49.53 NOT-1.4
NOT-B  (via drill 0.35)
  Top 0.4: v247.65,31.75 247.65,38.1 246.38,39.37 231.14,39.37 224.79,45.72 224.79,58.42 v219.71,63.5 | v201.93,71.5 v201.93,74.93
  Bottom 0.4: NOT-B.19 246.38,20.32 247.65,21.59 v247.65,31.75 | v219.71,63.5 211.84,71.37 202.06,71.37 v201.93,71.5 | v201.93,74.93 201.93,81.28 199.39,83.82 191.77,83.82 JP1.6
OF  (via drill 0.35)
  Top 0.4: v100.97,58.42 100.97,62.87 101.6,63.5 104.14,63.5 104.65,64.01 104.65,75.69 v104.14,76.2 | v118.11,76.2 v129.54,76.2 | v160.02,76.2 v218.44,76.2
  Bottom 0.4: ADDER-H.9 101.6,54.61 100.97,55.24 v100.97,58.42 | v104.14,76.2 v118.11,76.2 | v129.54,76.2 v160.02,76.2 | JP2.5 219.33,81.28 218.44,80.39 v218.44,76.2
OR-0
  Bottom 0.4: OR-B.2 OR0.2 307.34,29.21 300.23,36.32 288.8,36.32 288.29,36.83 288.29,39.37 292.1,43.18 308.61,43.18 311.15,45.72 OR-0.3
OR-1
  Top 0.4: OR1.2 304.8,29.21 318.77,43.18 OR-0.6
  Bottom 0.4: OR-B.3 OR1.2
OR-2
  Top 0.4: OR-0.8 321.31,54.61 317.5,50.8 317.5,45.72 302.26,30.48 OR2.2
  Bottom 0.4: OR2.2 OR-B.4
OR-3
  Bottom 0.4: OR-B.5 OR3.2 299.72,28.83 295.91,32.64 290.45,32.64 287.02,36.07 287.02,45.72 293.12,51.82 310.9,51.82 313.69,54.61 OR-0.11
OR-4
  Bottom 0.4: OR-B.6 OR4.2 294.26,30.48 289.56,30.48 275.59,44.45 OR-1.3
OR-5
  Bottom 0.4: OR-B.7 OR5.2 292.99,29.21 289.56,29.21 274.32,44.45 274.32,49.78 274.83,50.29 276.23,50.29 276.86,49.66 276.86,47.12 278.38,45.59 281.81,45.59 283.21,46.99 OR-1.6
OR-6  (via drill 0.35)
  Top 0.4: v292.1,31.37 OR6.2
  Bottom 0.4: OR6.2 OR-B.8 | OR-1.8 285.75,53.34 284.48,52.07 284.48,37.21 290.32,31.37 v292.1,31.37
OR-7
  Bottom 0.4: OR-B.9 OR7.2 271.78,45.34 271.78,50.8 274.32,53.34 276.86,53.34 278.13,54.61 OR-1.11
OR-B  (via drill 0.35)
  Top 0.4: OR-B.19 307.34,19.05 303.53,22.86 287.02,22.86 v270.51,39.37 | v260.35,57.15 248.92,68.58 228.6,68.58 v222.25,74.93 | v219.71,77.47 214.63,77.47 203.2,88.9 189.13,88.9 v187.96,87.73
  Bottom 0.4: v270.51,39.37 261.62,39.37 260.35,40.64 v260.35,57.15 | v222.25,74.93 v219.71,77.47 | v187.96,87.73 JP1.4
S0
  Top 0.4: S0.2 118.11,46.61 125.86,54.36 125.86,54.74 | ADDER-L.4 124.46,62.23 125.86,60.83 125.86,54.74 | ZF-0.1 149.86,50.8 145.92,54.74 125.86,54.74
  Bottom 0.4: S0.2 ADDER-B.2
S1
  Top 0.4: ADDER-L.1 120.65,54.61 116.84,50.8 116.84,39.37 S1.2 | ZF-0.2 147.32,50.8 144.27,53.85 126.36,53.85 119.38,46.86 119.38,34.29 118.75,33.66 116.71,33.66 115.57,34.8 ADDER-B.3
  Bottom 0.4: S1.2 ADDER-B.3
S2
  Top 0.4: ADDER-L.13 116.84,62.23 118.49,60.58 118.49,53.47 116.84,51.82 114.81,51.82 114.3,51.31 114.3,39.37 S2.2
  Bottom 0.4: ADDER-B.4 S2.2 113.03,41.91 116.84,45.72 122.94,45.72 129.29,52.07 140.97,52.07 142.24,50.8 ZF-0.4
S3
  Top 0.4: S3.2 110.49,45.72 111.76,46.99 111.76,50.42 114.43,53.09 116.84,53.09 117.6,53.85 117.6,60.2 116.84,60.96 114.3,60.96 113.54,61.72 113.54,62.74 114.43,63.63 116.84,63.63 117.6,64.39 117.6,68.71 116.46,69.85 ADDER-L.10
  Bottom 0.4: S3.2 ADDER-B.5 110.49,34.92 111.89,33.53 113.54,33.53 114.3,34.29 114.3,41.91 115.57,43.18 121.92,43.18 130.05,51.31 139.19,51.31 139.7,50.8 ZF-0.5
S4
  Top 0.4: ADDER-H.4 96.52,64.77 97.79,63.5 97.79,50.8 95.25,48.26 95.25,34.29 97.41,32.13 104.52,32.13 ADDER-B.6
  Bottom 0.4: S4.2 ADDER-B.6 110.87,32.64 114.05,32.64 115.06,33.66 121.28,33.66 131.44,43.81 136.53,43.81 137.16,43.18 ZF-0.9
S5
  Top 0.4: ADDER-H.1 96.52,72.39 99.06,69.85 99.06,50.8 96.52,48.26 96.52,34.29 97.92,32.89 103.5,32.89 105.41,34.8 ADDER-B.7
  Bottom 0.4: S5.2 ADDER-B.7 109.09,31.88 120.78,31.88 128.02,39.12 138.05,39.12 139.7,40.77 ZF-0.10
S6
  Top 0.4: ADDER-B.8 102.87,34.29 102.23,33.66 99.69,33.66 99.06,34.29 99.06,49.15 100.08,50.16 100.08,63.25 101.6,64.77 ADDER-H.13
  Bottom 0.4: S6.2 ADDER-B.8 107.31,31.11 121.54,31.11 128.52,38.1 140.97,38.1 ZF-0.12
S7  (via drill 0.35)
  Top 0.4: S7.2 100.33,45.72 101.6,46.99 101.6,52.58 100.84,53.34 100.84,56.26 101.73,57.15 ADDER-H.10 | v160.02,72.39 v168.91,72.39
  Bottom 0.4: ZF-0.13 147.32,40.64 143.89,37.21 129.29,37.21 122.3,30.23 105.66,30.23 ADDER-B.9 S7.2 109.22,46.99 121.92,46.99 132.08,57.15 132.08,67.31 137.16,72.39 v160.02,72.39 | v168.91,72.39 215.9,72.39 217.17,73.66 217.17,82.55 218.44,83.82 226.06,83.82 227.33,82.55 JP2.1
SUB  (via drill 0.35)
  Top 0.4: ADD-X-0.5 127,86.36 | 127,86.36 ADD-X-0.10 | ADD-X-0.13 127,93.98 | 127,86.36 127,93.98 | 127,93.98 ADD-X-0.2 | ADD-X-1.5 95.25,86.36 | 95.25,86.36 ADD-X-1.10 | 95.25,86.36 95.25,93.98 | ADD-X-1.13 95.25,93.98 | 95.25,93.98 ADD-X-1.2 | v154.94,86.36 182.88,86.36 183.51,87 196.6,87 197.49,86.11 197.49,83.19 196.85,82.55 JP1.9
  Bottom 0.4: ADD-X-1.13 104.14,93.98 107.95,90.17 116.33,90.17 120.14,93.98 ADD-X-0.2 | ADDER-L.7 124.46,69.85 125.22,70.61 125.22,83.69 122.56,86.36 ADD-X-0.5 | ADD-X-0.10 v154.94,86.36
T0
  Bottom 0.4: T0.2 ADD-X-0.3 126.11,87.25 126.11,68.96 124.46,67.31 ADDER-L.6
T1  (via drill 0.35)
  Top 0.4: v120.65,59.69 120.65,58.42 121.92,57.15 ADDER-L.2
  Bottom 0.4: T1.2 ADD-X-0.6 123.19,83.82 124.08,82.93 124.08,79.63 120.65,76.2 v120.65,59.69
T2
  Top 0.4: ADD-X-0.8 127,78.74 116.71,78.74 112.65,74.68 112.65,58.8 114.3,57.15 ADDER-L.15
  Bottom 0.4: T2.2 ADD-X-0.8
T3
  Top 0.4: T3.2 134.62,81.28 130.81,77.47 116.84,77.47 113.54,74.17 113.54,68.33 114.55,67.31 ADDER-L.11
  Bottom 0.4: ADD-X-0.11 T3.2
T4  (via drill 0.35)
  Top 0.4: T4.2 83.82,91.44 80.01,87.63 v80.01,85.09
  Bottom 0.4: T4.2 ADD-X-1.3 | v80.01,85.09 83.82,81.28 83.82,77.47 92.71,68.58 92.71,60.96 93.98,59.69 ADDER-H.6
T5
  Bottom 0.4: ADD-X-1.6 T5.2 85.09,78.74 93.98,69.85 ADDER-H.2
T6
  Top 0.4: ADDER-H.15 101.6,69.85 100.33,71.12 T6.2
  Bottom 0.4: T6.2 ADD-X-1.8
T7
  Top 0.4: T7.2 105.41,86.36 105.41,60.96 104.14,59.69 ADDER-H.11
  Bottom 0.4: ADD-X-1.11 T7.2
VCC  (via drill 0.35)
  Top 0.4: C1.+ 15.75,64.77 ACC.20 29.21,63.5 29.21,52.07 ACC-B.20 | v107.95,71.12 107.95,62.23 ADDER-L.16 | 120.02,29.84 119.89,29.97 C2.+ 90.93,30.48 v77.47,30.48 | 120.02,29.84 120.65,29.21 ADDER-B.20 | 120.02,29.84 120.65,30.48 ADDER-B.1 129.54,44.45 147.32,44.45 ZF-0.14 151.13,43.18 152.4,43.18 156.21,46.99 156.21,53.34 AND-1.14 158.75,57.15 160.53,58.93 182.37,58.93 AND-0.14 185.42,57.15 187.96,59.69 201.93,59.69 203.2,58.42 203.2,55.88 | v119.38,55.88 119.38,60.96 121.92,63.5 132.08,63.5 ZF-1.14 | AND-B.20 AND-B.1 187.96,38.1 194.31,44.45 200.66,44.45 203.2,46.99 203.2,55.88 | v73.66,30.48 v58.42,30.48 | v30.48,31.75 30.48,39.37 v31.75,40.64 | NOT-1.14 203.2,55.88 | NOT-B.1 248.92,43.18 251.46,45.72 NOT-0.14 259.08,55.88 OR-1.14 270.51,57.15 271.78,58.42 290.83,58.42 | C5.+ 250.95,23.37 NOT-B.1 | NOT-B.1 248.92,21.59 | 248.92,21.59 NOT-B.20 | C3.+ 196.09,21.59 248.92,21.59 | 290.83,58.42 v292.1,58.42 | 290.83,58.42 292.1,59.69 321.31,59.69 323.85,57.15 v323.85,55.88 323.85,44.45 311.15,31.75 | OR-B.1 309.88,30.48 311.15,31.75 | C7.+ 371.35,25.4 XOR-B.1 XOR-B.20 372.11,17.78 373.38,16.51 v374.65,16.51 | XOR-1.14 v334.01,52.07 | XOR-0.14 362.46,54.1 366.27,54.1 v369.57,50.8 | CMP-L.16 384.81,17.78 392.43,17.78 393.7,19.05 393.7,22.86 392.43,24.13 CMP-L.3 | C6.+ 311.15,31.24 311.15,31.75 | ADDER-H.16 101.6,73.66 101.6,90.17 104.01,92.58 v104.01,96.39
  Bottom 0.4: v107.95,71.12 106.68,72.39 ADDER-H.16 | ADDER-L.16 116.84,55.88 v119.38,55.88 | ADD-X-1.14 103.89,96.52 v104.01,96.39 107.82,92.58 117.35,92.58 120.02,95.25 124.46,95.25 125.73,96.52 ADD-X-0.14 | v77.47,30.48 v73.66,30.48 | v58.42,30.48 36.83,30.48 34.67,32.64 31.37,32.64 v30.48,31.75 | v31.75,40.64 31.75,46.99 30.48,48.26 ACC-B.20 | C3.+ 189.99,23.37 AND-B.1 | OR-B.1 OR-B.20 | v292.1,58.42 303.53,58.42 OR-0.14 | v334.01,52.07 359.41,52.07 360.68,53.34 XOR-0.14 | v369.57,50.8 373.38,50.8 | 373.38,50.8 374.65,49.53 374.65,24.64 C7.+ | XOR-1.14 v323.85,55.88 | AND-1.14 154.43,60.2 C4.+ 153.16,69.85 135.89,69.85 134.62,68.58 ZF-1.14 | CMP-H.16 378.46,49.53 377.19,50.8 373.38,50.8 | CMP-L.16 381,16.51 v374.65,16.51 | JP3.2 9.4,67.82 C1.+
XOR-0
  Top 0.4: XOR0.2 XOR-B.2
  Bottom 0.4: XOR-0.3 367.54,46.48 367.54,34.8 364.49,31.75 XOR0.2
XOR-1
  Top 0.4: XOR-B.3 XOR1.2
  Bottom 0.4: XOR-B.3 361.95,24.13 362.71,23.37 365.12,23.37 365.76,24 365.76,29.97 368.55,32.77 368.55,44.7 369.57,45.72 372.11,45.72 373.38,46.99 XOR-0.6
XOR-2
  Top 0.4: XOR2.2 XOR-B.4
  Bottom 0.4: XOR-0.8 375.92,54.61 374.65,53.34 367.03,53.34 364.49,50.8 364.49,45.72 366.52,43.69 366.52,35.81 359.41,28.7 XOR2.2
XOR-3
  Top 0.4: XOR-B.5 XOR3.2
  Bottom 0.4: XOR3.2 365.76,36.45 365.76,43.18 361.95,46.99 361.95,49.53 XOR-0.11
XOR-4
  Top 0.4: XOR4.2 XOR-B.6
  Bottom 0.4: XOR4.2 354.33,27.94 352.04,30.23 345.82,30.23 339.09,36.96 XOR-1.3
XOR-5
  Top 0.4: XOR-B.7 XOR5.2
  Bottom 0.4: XOR-1.6 346.71,49.53 346.2,50.04 338.33,50.04 337.82,49.53 337.82,36.83 345.44,29.21 350.52,29.21 351.79,27.94 XOR5.2
XOR-6
  Top 0.4: XOR-B.8 XOR6.2 349.25,27.94 347.98,29.21 345.44,29.21 337.82,36.83 337.82,41.91 340.36,44.45 346.71,44.45 347.98,45.72 347.98,52.07 349.25,53.34 XOR-1.8
XOR-7
  Top 0.4: XOR-B.9 XOR7.2 344.55,27.56 335.28,36.83 335.28,50.8 337.82,53.34 340.36,53.34 341.63,54.61 XOR-1.11
XOR-B  (via drill 0.35)
  Top 0.4: v346.96,60.07 348.87,60.07 351.79,57.15 351.79,54.61 363.22,43.18 363.22,22.86 364.49,21.59 XOR-B.19 | v218.44,74.93 v205.74,74.93
  Bottom 0.4: v346.96,60.07 346.84,59.94 333.12,59.94 332.23,59.05 320.68,59.05 312.42,67.31 226.06,67.31 v218.44,74.93 | v205.74,74.93 205.74,83.82 202.56,87 194.44,87 193.04,85.6 JP1.8
ZF
  Top 0.4: ZF-1.8 149.86,67.31 153.16,70.61 215.39,70.61 220.73,75.95 220.73,81.66 221.62,82.55 223.52,82.55 JP2.3